# EAGLE design hibrido (EAGLE 9.6.2)
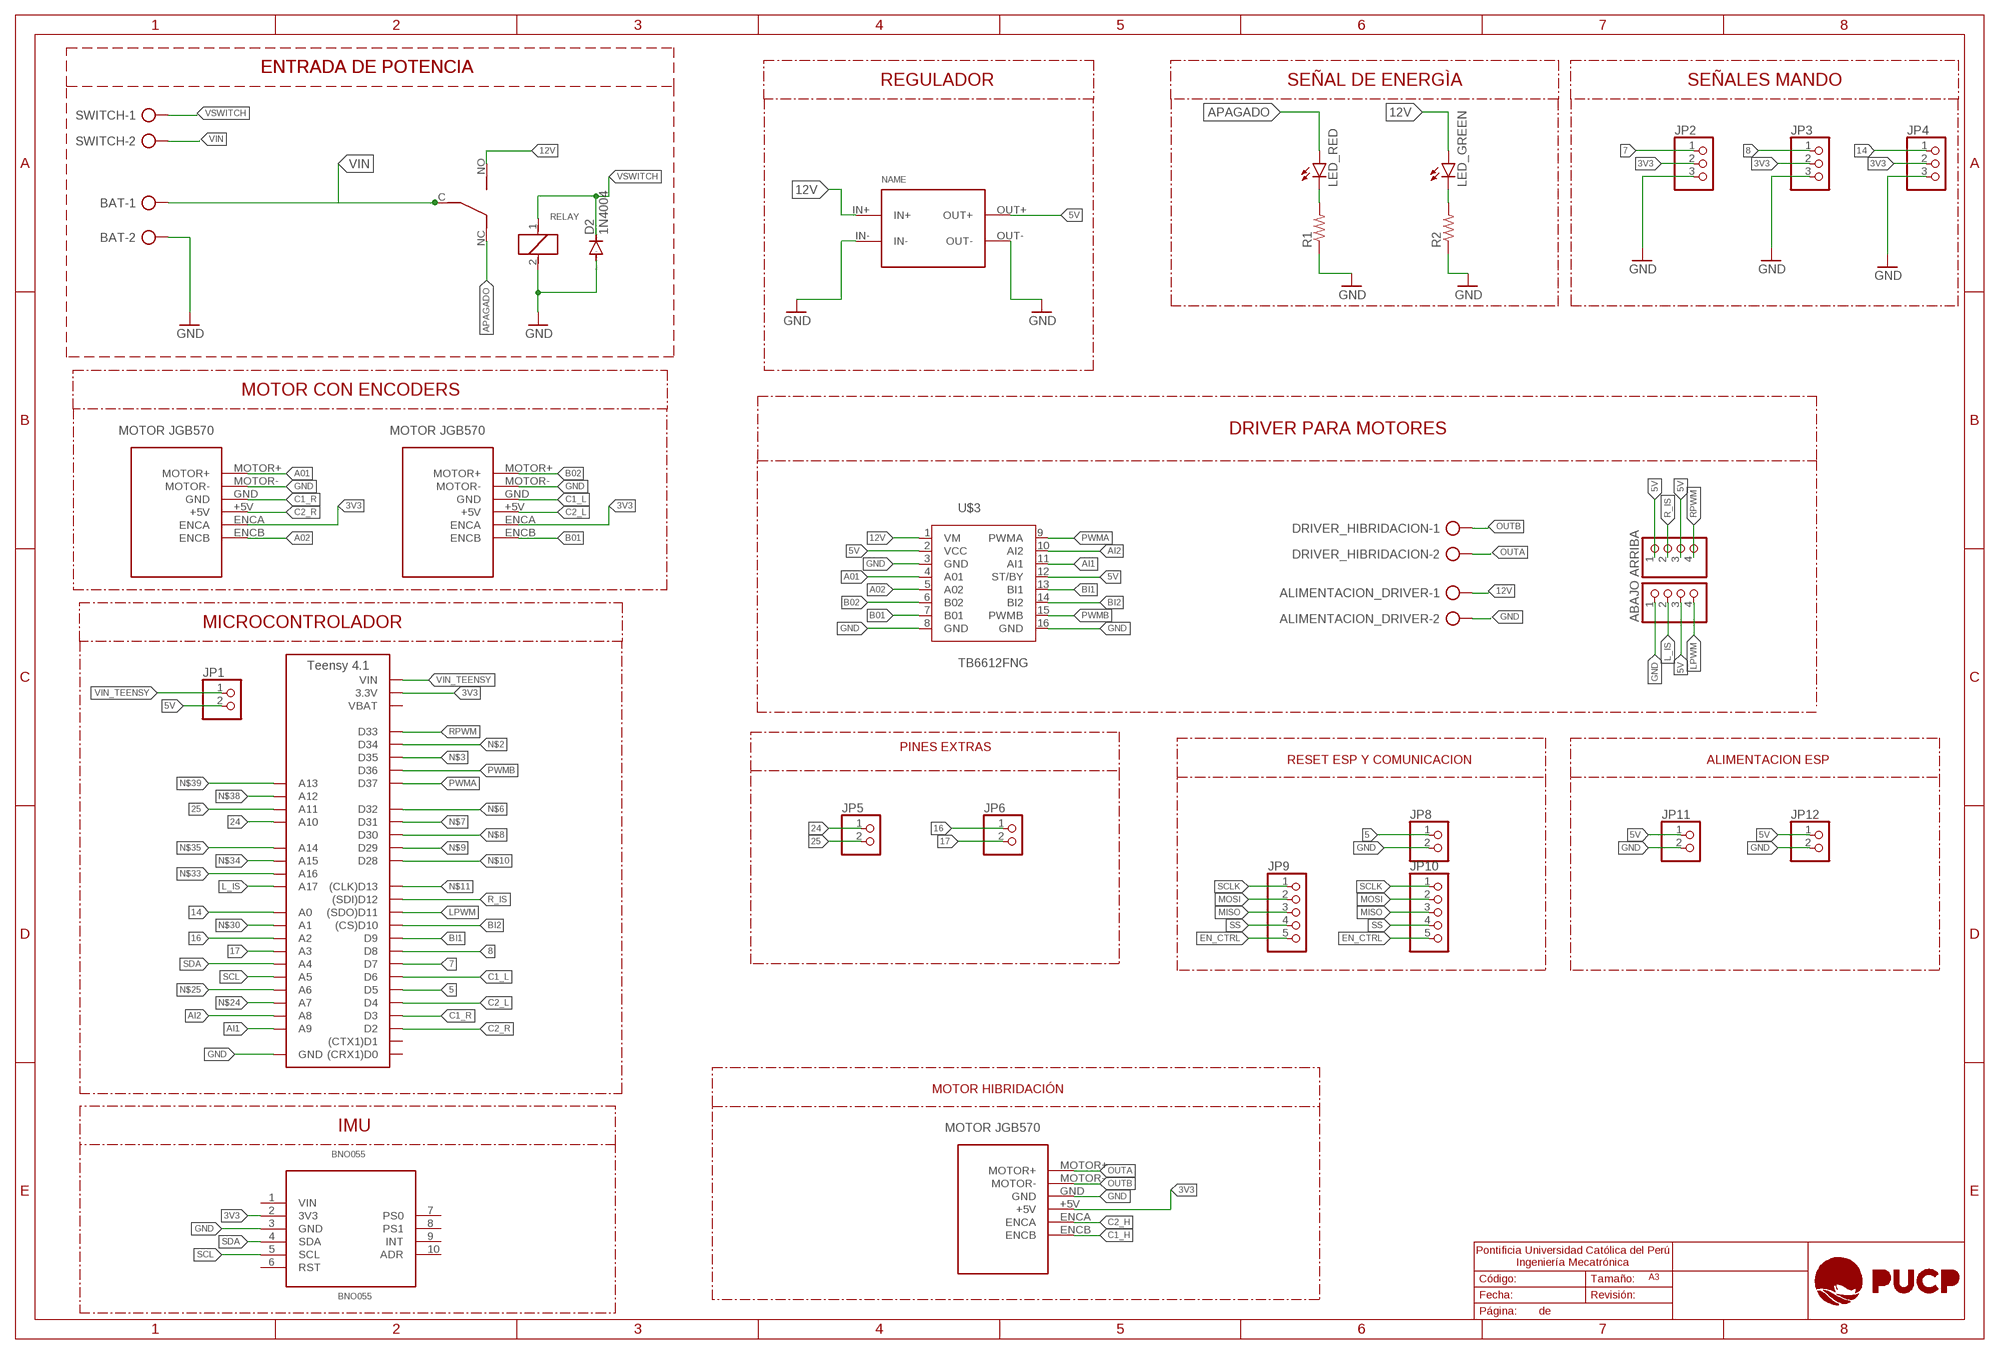
[diagram p0: schematic, sheet 1]

## Parts
A1  TEENSY_4.1  [TEENSY_LONG_EXT]
ABAJO  PINHD-1X4  [1X04]
ALIMENTACION_DRIVER  AK500/2-H  [AK500/2-H]
ARRIBA  PINHD-1X4  [1X04]
BAT  AK500/2-H  [AK500/2-H]
BNO055  BNO055  [BNO055]
D2  1N4004  [DO41-10]
DRIVER_HIBRIDACION  AK500/2-H  [AK500/2-H]
JP1  PINHD-1X2  [1X02]
JP2  PINHD-1X3  [1X03]
JP3  PINHD-1X3  [1X03]
JP4  PINHD-1X3  [1X03]
JP5  PINHD-1X2  [1X02]
JP6  PINHD-1X2  [1X02]
JP8  PINHD-1X2  [1X02]
JP9  PINHD-1X5  [1X05]
JP10  PINHD-1X5  [1X05]
JP11  PINHD-1X2  [1X02]
JP12  PINHD-1X2  [1X02]
LED_GREEN  LED5MM  [LED5MM]
LED_RED  LED5MM  [LED5MM]
MOTOR1  MOTOR_JGB370  [MOTOR_JGB370]
MOTOR3  MOTOR_JGB370  [MOTOR_JGB370]
MOTOR5  MOTOR_JGB370  [MOTOR_JGB370]
R1  R-US_0207/10  [0207/10]
R2  R-US_0207/10  [0207/10]
REG  CP8-ADJ  [CP8-ADJ]
RELAY  RELAY12V  [RELAY12V]
SWITCH  AK500/2-H  [AK500/2-H]
U$3  TB6612FNG  [TB6612FNG]

## Nets
3V3: A1.3V3(3.3V) A1.3V3@2(3.3V) A1.3V3@3(3.3V) BNO055.2(3V3) JP2.2 JP3.2 JP4.2 MOTOR1.+5V MOTOR3.ENCA MOTOR5.ENCA
5: A1.D5 JP8.1
5V: ABAJO.3 ARRIBA.1 ARRIBA.3 JP1.2 JP11.1 JP12.1 REG.OUT+ U$3.2(VCC) U$3.12(ST/BY)
7: A1.D7 JP2.1
8: A1.D8 JP3.1
12V: ALIMENTACION_DRIVER.1 LED_GREEN.A REG.IN+ RELAY.NO U$3.1(VM)
14: A1.D14(A0) JP4.1
16: A1.D16(A2) JP6.1
17: A1.D17(A3) JP6.2
24: A1.D24(A10) JP5.1
25: A1.D25(A11) JP5.2
A01: MOTOR3.MOTOR+ U$3.4(A01)
A02: MOTOR3.ENCB U$3.5(A02)
AI1: A1.D23(A9) U$3.11(AI1)
AI2: A1.D22(A8) U$3.10(AI2)
APAGADO: LED_RED.A RELAY.NC
B01: MOTOR5.ENCB U$3.7(B01)
B02: MOTOR5.MOTOR+ U$3.6(B02)
BI1: A1.D9 U$3.13(BI1)
BI2: A1.D10((CS)D10) U$3.14(BI2)
C1_H: MOTOR1.ENCB
C1_L: A1.D6 MOTOR5.GND
C1_R: A1.D3 MOTOR3.GND
C2_H: MOTOR1.ENCA
C2_L: A1.D4 MOTOR5.+5V
C2_R: A1.D2 MOTOR3.+5V
EN_CTRL: JP9.5 JP10.5
GND: A1.AGND/GND(GND) A1.GND A1.GND@2(GND) ABAJO.1 ALIMENTACION_DRIVER.2 BAT.2 BNO055.3(GND) D2.A JP2.3 JP3.3 JP4.3 JP8.2 JP11.2 JP12.2 MOTOR1.GND MOTOR3.MOTOR- MOTOR5.MOTOR- R1.1 R2.1 REG.IN- REG.OUT- RELAY.2 U$3.3(GND) U$3.8(GND) U$3.16(GND)
L_IS: A1.D41(A17) ABAJO.2
LPWM: A1.D11((SDO)D11) ABAJO.4
MISO: JP9.3 JP10.3
MOSI: JP9.2 JP10.2
N$1: LED_RED.K(C) R1.2
N$2: A1.D34
N$3: A1.D35
N$4: LED_GREEN.K(C) R2.2
N$6: A1.D32
N$7: A1.D31
N$8: A1.D30
N$9: A1.D29
N$10: A1.D28
N$11: A1.D13((CLK)D13)
N$24: A1.D21(A7)
N$25: A1.D20(A6)
N$30: A1.D15(A1)
N$33: A1.D40(A16)
N$34: A1.D39(A15)
N$35: A1.D38(A14)
N$38: A1.D26(A12)
N$39: A1.D27(A13)
OUTA: DRIVER_HIBRIDACION.2 MOTOR1.MOTOR+
OUTB: DRIVER_HIBRIDACION.1 MOTOR1.MOTOR-
PWMA: A1.D37 U$3.9(PWMA)
PWMB: A1.D36 U$3.15(PWMB)
R_IS: A1.D12((SDI)D12) ARRIBA.2
RPWM: A1.D33 ARRIBA.4
SCL: A1.D19(A5) BNO055.5(SCL)
SCLK: JP9.1 JP10.1
SDA: A1.D18(A4) BNO055.4(SDA)
SS: JP9.4 JP10.4
VIN: BAT.1 RELAY.C SWITCH.2
VIN_TEENSY: A1.VIN JP1.1
VSWITCH: D2.C RELAY.1 SWITCH.1
Unconnected: A1.D0((CRX1)D0) A1.D1((CTX1)D1) BNO055.1(VIN) BNO055.6(RST) BNO055.7(PS0) BNO055.8(PS1) BNO055.9(INT) BNO055.10(ADR)

## Notes on the sheet
- ENTRADA DE POTENCIA | ENTRADA DE POTENCIA
- REGULADOR | SEÑAL DE ENERGÌA | SEÑALES MANDO
- MOTOR CON ENCODERS
- DRIVER PARA MOTORES
- MICROCONTROLADOR
- PINES EXTRAS
- RESET ESP Y COMUNICACION | ALIMENTACION ESP
- MOTOR HIBRIDACIÓN
- IMU
- A3

## Power pins joined to a net without a drawn wire
VBAT: A1.VBAT

## Library data of the parts
A1 = TEENSY_4.1:TEENSY_4.1: Check availability <https://pricing.snapeda.com/parts/Teensy%204.1/PJRC/view-part?ref=eda>; AVAILABILITY: Not in stock; CHECK_PRICES: https://www.snapeda.com/parts/Teensy%204.1/PJRC/view-part/?ref=eda; MF: PJRC; MP: Teensy 4.1; PACKAGE: None; PRICE: None; SNAPEDA_LINK: https://www.snapeda.com/parts/Teensy%204.1/PJRC/view-part/?ref=snap
ABAJO ARRIBA = pinhead:PINHD-1X4: PIN HEADER
ALIMENTACION_DRIVER BAT DRIVER_HIBRIDACION SWITCH = con-ptr500:AK500/2-H: CONNECTOR Aug. 2004 / PTR Meßtechnik: Die Bezeichnung der Serie AK505 wurde geändert. Es handelt sich hierbei um AK500 in horizontaler Ausführung.; OC_FARNELL: unknown; OC_NEWARK: unknown
BNO055 = BNO055:BNO055
D2 = diode:1N4004: DIODE general purpose rectifier, 1 A
JP1 JP5 JP6 JP8 JP11 JP12 = pinhead:PINHD-1X2: PIN HEADER
JP2-JP4 = pinhead:PINHD-1X3: PIN HEADER
JP9 JP10 = pinhead:PINHD-1X5: PIN HEADER
LED_GREEN LED_RED = led:LED: LED OSRAM: - CHIPLED LG R971, LG N971, LY N971, LG Q971, LY Q971, LO R971, LY R971 LH N974, LH R974 LS Q976, LO Q976, LY Q976 LO Q996 - Hyper CHIPLED LW Q18S LB Q993, LB Q99A, LB R99A - SideLED LS A670, LO A670, LY A670, LG A670, LP A670 LB A673, LV A673, LT A673, LW A673 LH A674 LY A675 LS A676, LA A676, LO A676, LY A676, LW A676 LS A679, LY A679, LG A679 - Hyper Micro SIDELED® LS Y876, LA Y876, LO Y876, LY Y876 LT Y87S - SmartLED LW L88C, LW L88S LB L89C, LB L89S, LG L890 LS L89K, LO L89K, LY L89K LS L896, LA L896, LO L896, LY L896 - TOPLED LS T670, LO T670, LY T670, LG T670, LP T670 LSG T670, LSP T670, LSY T670, LOP T670, LYG T670 LG T671, LOG T671, LSG T671 LB T673, LV T673, LT T673, LW T673 LH T674 LS T676, LA T676, LO T676, LY T676, LB T676, LH T676, LSB T676, LW T676 LB T67C, LV T67C, LT T67C, LS T67K, LO T67K, LY T67K, LW E67C LS E67B, LA E67B, LO E67B, LY E67B, LB E67C, LV E67C, LT E67C LW T67C LS T679, LY T679, LG T679 LS T770, LO T770, LY T770, LG T770, LP T770 LB T773, LV T773, LT T773, LW T773 LH T774 LS E675, LA E675, LY E675, LS T675 LS T776, LA T776, LO T776, LY T776, LB T776 LHGB T686 LT T68C, LB T68C - Hyper Mini TOPLED® LB M676 - Mini TOPLED Santana® LG M470 LS M47K, LO M47K, LY M47K Source: http://www.osram.convergy.de LUXEON: - LUMILED® LXK2-PW12-R00, LXK2-PW12-S00, LXK2-PW14-U00, LXK2-PW14-V00 LXK2-PM12-R00, LXK2-PM12-S00, LXK2-PM14-U00 LXK2-PE12-Q00, LXK2-PE12-R00, LXK2-PE12-S00, LXK2-PE14-T00, LXK2-PE14-U00 LXK2-PB12-K00, LXK2-PB12-L00, LXK2-PB12-M00, LXK2-PB14-N00, LXK2-PB14-P00, LXK2-PB14-Q00 LXK2-PR12-L00, LXK2-PR12-M00, LXK2-PR14-Q00, LXK2-PR14-R00 LXK2-PD12-Q00, LXK2-PD12-R00, LXK2-PD12-S00 LXK2-PH12-R00, LXK2-PH12-S00 LXK2-PL12-P00, LXK2-PL12-Q00, LXK2-PL12-R00 Source: www.luxeon.com KINGBRIGHT: KA-3528ASYC Source: www.kingbright.com
MOTOR1 MOTOR3 MOTOR5 = MOTOR_JGB370:MOTOR_JGB370
R1 R2 = rcl:R-US_: RESISTOR, American symbol; SPICEPREFIX: R
REG = userlib:CP8-ADJ: Voltage regulator IN: 7-35V OUT: ADJ; SPICEPREFIX: E
RELAY = ModularRobot:RELAY12V: Library for the 12V relay component available in Peru. Done by Jimm Cisneros.
U$3 = TB6612FNG:TB6612FNG

## Board
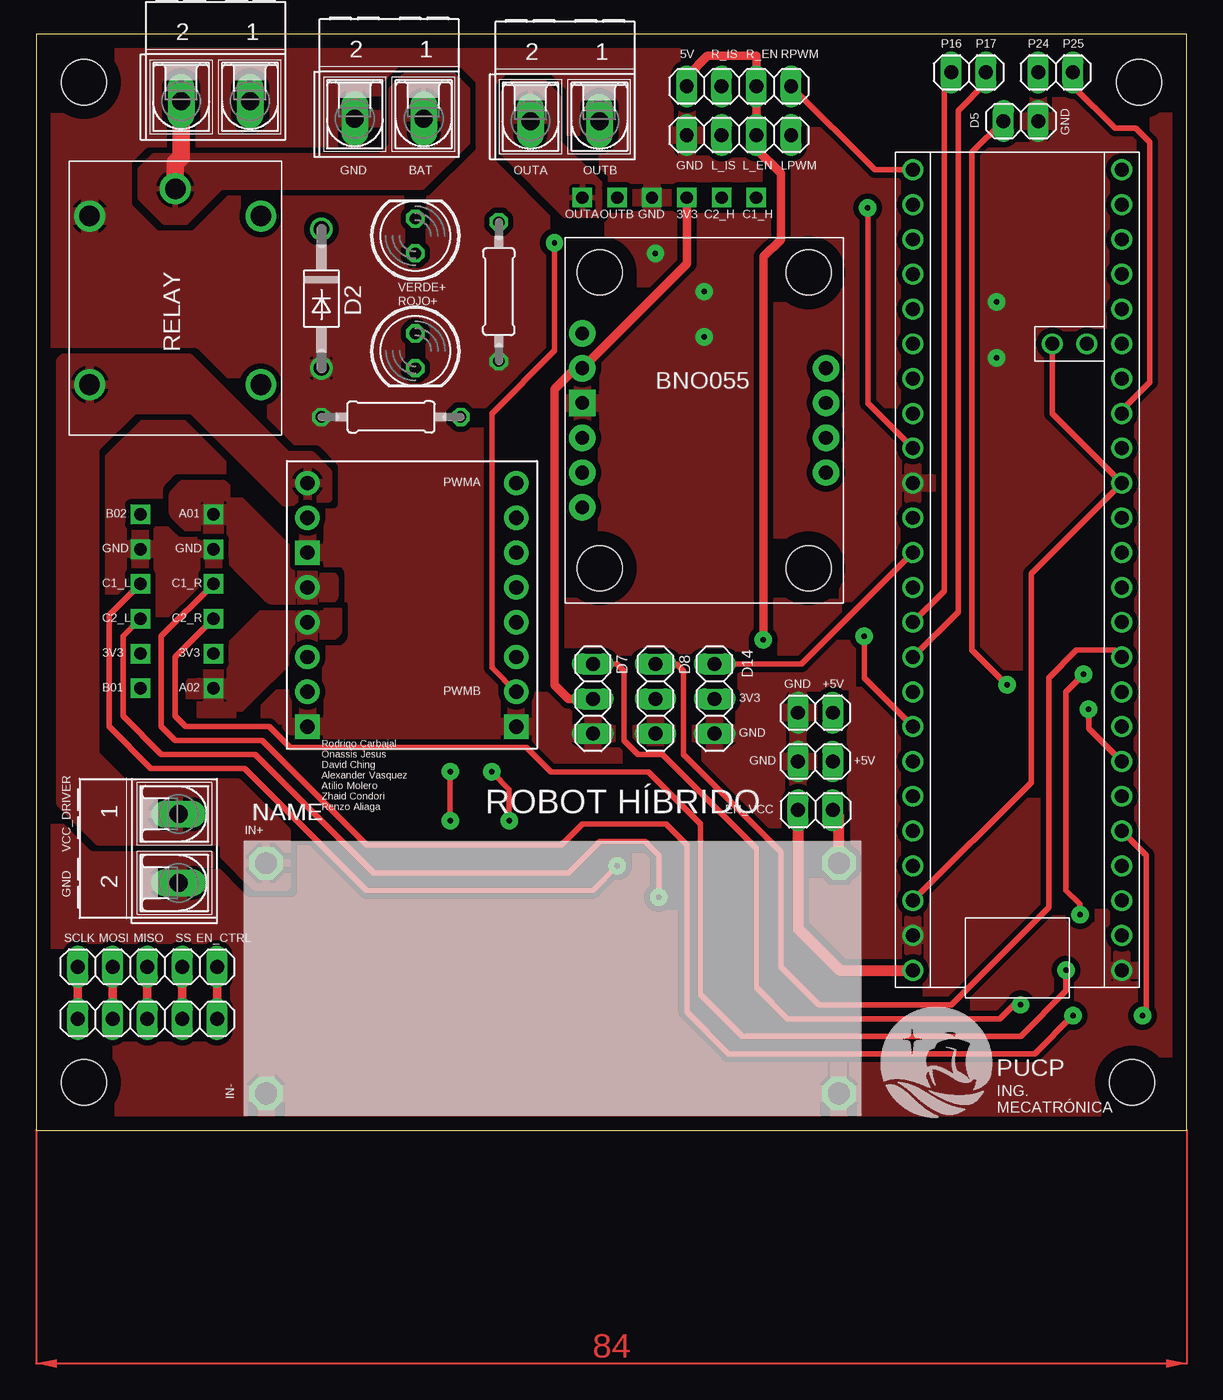
[diagram p1: board, top side]
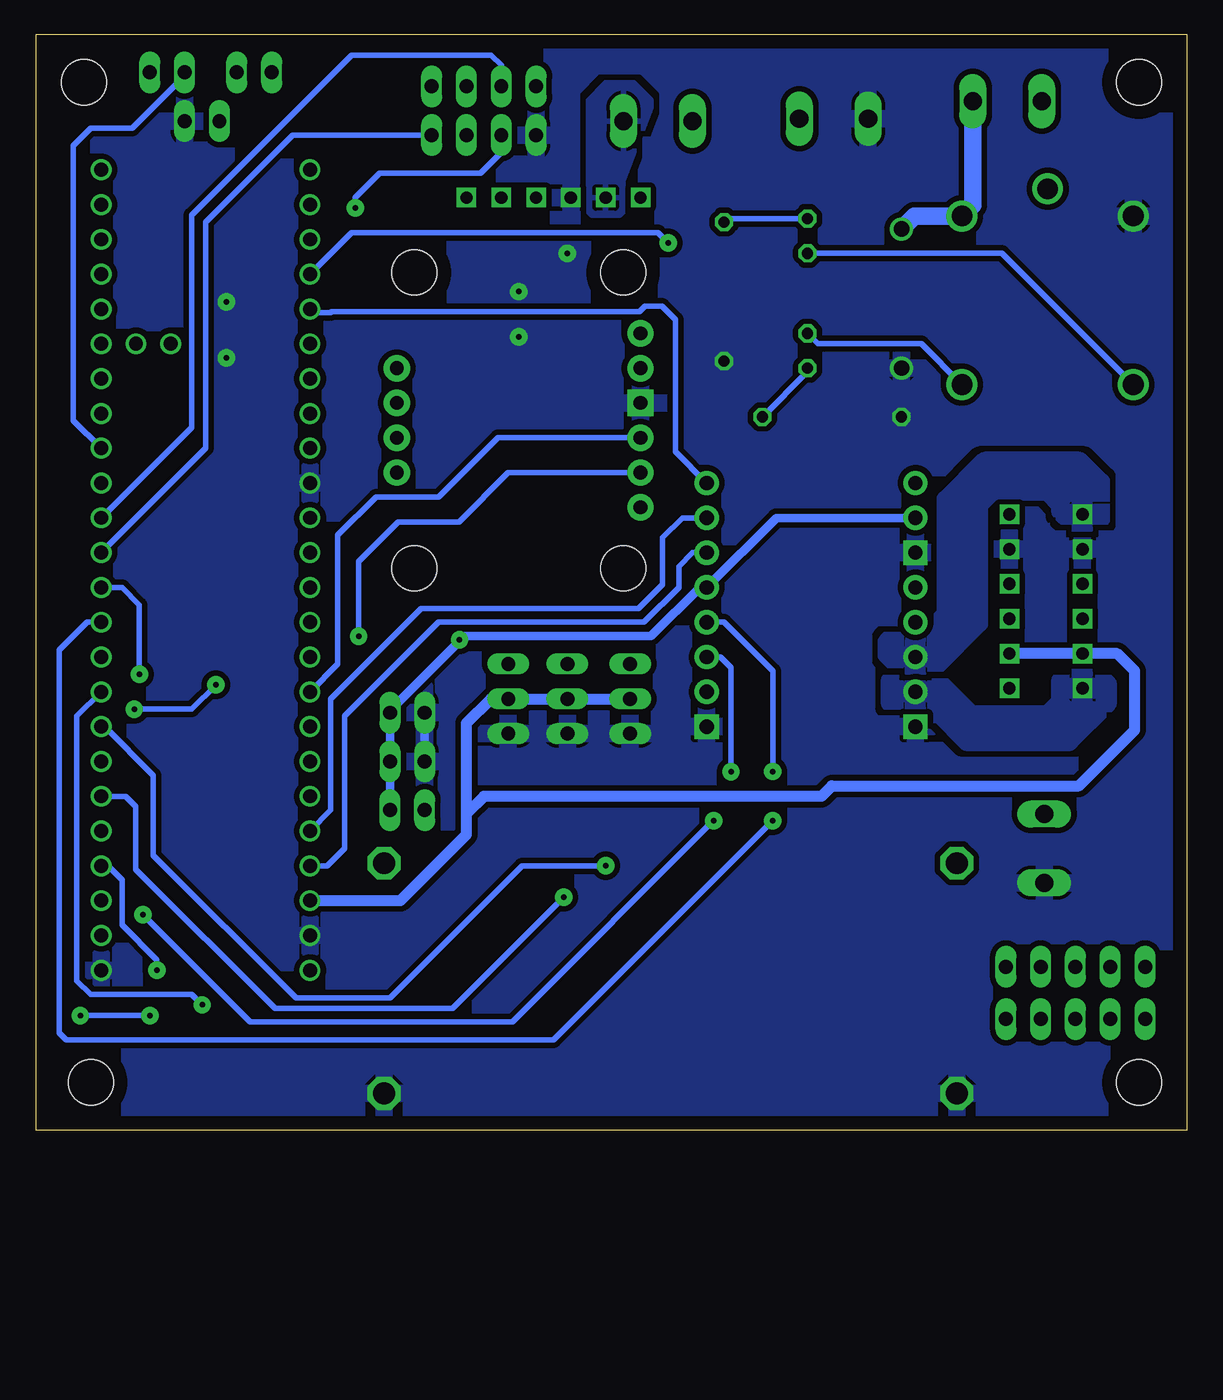
[diagram p2: board, bottom side, seen from below]

Size 84 x 80 mm. Coordinates in mm from the lower left corner, seen from the top.
Outline: 0,0 84,0 84,80 0,80 0,0
Copper layers (1*16): Top 0.035mm / dielectric 1.5mm / Bottom 0.035mm
Design rules "default *": minimum track width 6mil, minimum drill 0.35mm, track to track 12mil, track to pad 12mil, pad to pad 12mil, via to via 12mil, smd to smd 6mil, copper to edge 40mil, drill to drill 6mil, minimum pad ring 10mil, minimum via ring 8mil, stop-mask expansion 4mil, vias tented up to drill 0mil, thermal gap 10mil
Holes 3.3 mm at 3.5,76.5 3.5,3.5 80,3.5 80.5,76.5

### Footprints (pad centres in the part's own frame; a part is rotated, then mirrored left to right if it is on the bottom)
TEENSY_LONG_EXT = drill 1.016: 3V3 0,5.08; 3V3@2 15.24,35.56; 3V3@3 10.16,45.72; AGND/GND 0,2.54; D0 15.24,2.54; D1 15.24,5.08; D2 15.24,7.62; D3 15.24,10.16; D4 15.24,12.7; D5 15.24,15.24; D6 15.24,17.78; D7 15.24,20.32; D8 15.24,22.86; D9 15.24,25.4; D10 15.24,27.94; D11 15.24,30.48; D12 15.24,33.02; D13 0,33.02; D14 0,30.48; D15 0,27.94; D16 0,25.4; D17 0,22.86; D18 0,20.32; D19 0,17.78; D20 0,15.24; D21 0,12.7; D22 0,10.16; D23 0,7.62; D24 15.24,38.1; D25 15.24,40.64; D26 15.24,43.18; D27 15.24,45.72; D28 15.24,48.26; D29 15.24,50.8; D30 15.24,53.34; D31 15.24,55.88; D32 15.24,58.42; D33 0,58.42; D34 0,55.88; D35 0,53.34; D36 0,50.8; D37 0,48.26; D38 0,45.72; D39 0,43.18; D40 0,40.64; D41 0,38.1; GND 15.24,0; GND@2 0,35.56; VBAT 12.7,45.72; VIN 0,0
1X04 = drill 1.016 long: 1 -3.81,0; 2 -1.27,0; 3 1.27,0; 4 3.81,0
AK500/2-H = drill 1.321 long: 1 -2.515,0; 2 2.515,0
BNO055 = drill 1 pad 1.93: 1 -8.89,6.35; 2 -8.89,3.81; 4 -8.89,-1.27; 5 -8.89,-3.81; 6 -8.89,-6.35; 7 8.89,3.81; 8 8.89,1.27; 9 8.89,-1.27; 10 8.89,-3.81 | drill 1 pad 1.93 square: 3 -8.89,1.27 | hole 3.3: -7.62,10.795; 7.62,10.795; -7.62,-10.795; 7.62,-10.795
DO41-10 = drill 1.118: A 5.08,0; C -5.08,0
1X02 = drill 1.016 long: 1 -1.27,0; 2 1.27,0
1X03 = drill 1.016 long: 1 -2.54,0; 2 0,0; 3 2.54,0
1X05 = drill 1.016 long: 1 -5.08,0; 2 -2.54,0; 3 0,0; 4 2.54,0; 5 5.08,0
LED5MM = drill 0.813 octagon: A -1.27,0; K 1.27,0
MOTOR_JGB370 = drill 0.9 pad 1.422 square: +5V -2.54,0; ENCA -5.08,0; ENCB -7.62,0; GND 0,0; MOTOR+ 5.08,0; MOTOR- 2.54,0
0207/10 = drill 0.813 octagon: 1 -5.08,0; 2 5.08,0
CP8-ADJ = drill 1.6 octagon: IN+ -21.81,7.05; IN- -21.81,-9.75; OUT+ 19.99,7.05; OUT- 19.99,-9.75
RELAY12V = drill 1.5: 1 16,-14; 2 16,-1.5; C 18,-7.75; NC 3.7,-14; NO 3.7,-1.5
TB6612FNG = drill 1.04 pad 1.778: 1 -7.62,8.89; 2 -7.62,6.35; 4 -7.62,1.27; 5 -7.62,-1.27; 6 -7.62,-3.81; 7 -7.62,-6.35; 9 7.62,8.89; 10 7.62,6.35; 11 7.62,3.81; 12 7.62,1.27; 13 7.62,-1.27; 14 7.62,-3.81; 15 7.62,-6.35 | drill 1.04 pad 1.778 square: 3 -7.62,3.81; 8 -7.62,-8.89; 16 7.62,-8.89

### Placement (x,y rotation side)
A1  64.01,11.68 0 top
ABAJO  51.31,72.64 0 top
ALIMENTACION_DRIVER  10.41,20.57 270 top
ARRIBA  51.31,76.2 0 top
BAT  25.78,73.84 180 top
BNO055  48.77,51.82 0 top
D2  20.83,60.71 270 top
DRIVER_HIBRIDACION  38.61,73.66 180 top
JP1  56.9,23.37 0 top
JP2  40.64,31.5 270 top
JP3  45.21,31.5 270 top
JP4  49.53,31.5 270 top
JP5  74.42,77.22 0 top
JP6  68.07,77.22 0 top
JP8  71.88,73.66 0 top
JP9  8.13,11.94 0 top
JP10  8.13,8.13 0 top
JP11  56.9,26.92 180 top
JP12  56.9,30.48 180 top
LED_GREEN  27.69,65.28 90 top
LED_RED  27.69,56.9 270 top
MOTOR1  44.96,68.07 180 top
MOTOR3  12.95,39.88 90 top
MOTOR5  7.62,39.88 90 top
R1  25.91,52.07 0 top
R2  33.78,61.21 90 top
REG  38.61,12.45 0 top
RELAY  2.41,50.73 90 top
SWITCH  13.11,75.11 180 top
U$3  27.43,38.35 0 top

### Tracks (layer width: path | path; a pad name or v marks a point on that pad's centre or on a via)
3V3
  Top 0.406: A1.3V3 72.64,25.4 72.64,40.64 A1.3V3@2 74.17,52.32 A1.3V3@3
  Top 0.61: JP2.2 38.86,31.5 37.85,32.51 37.85,54.1 39.37,55.63 BNO055.2 47.5,63.25 MOTOR1.+5V
  Bottom 0.813: A1.3V3 57.4,16.76 52.58,21.59 52.58,23.11 | JP2.2 JP3.2 JP4.2 50.8,31.5 52.58,29.72 52.58,23.11 | MOTOR3.ENCA MOTOR5.ENCA 5.08,34.8 3.81,33.53 3.81,29.21 7.87,25.15 25.91,25.15 26.67,24.38 51.31,24.38 52.58,23.11
5  (via drill 0.4 pad 1.27)
  Top 0.406: JP8.1 68.33,71.37 68.33,35.05 v70.87,32.51 | v76.83,30.73 76.83,29.34 A1.D5
  Bottom 0.406: v70.87,32.51 72.64,30.73 v76.83,30.73
5V  (via drill 0.4 pad 1.27)
  Top 0.61: v53.09,35.81 53.09,63.75 54.36,65.02 54.36,69.85 52.58,71.63 ABAJO.3 ARRIBA.3 52.58,78.44 49.02,78.44 47.5,76.91 ARRIBA.1
  Top 0.813: REG.OUT+ 58.6,22.94 JP1.2
  Bottom 0.61: U$3.2 29.97,44.7 U$3.12 35.55,39.62 39.11,36.07 52.83,36.07 v53.09,35.81 53.09,35.72 58.17,30.64 JP12.1 JP11.1 JP1.2
7  (via drill 0.4 pad 1.27)
  Top 0.406: JP2.1 42.42,34.04 42.93,33.53 42.93,28.45 43.94,27.43 45.72,27.43 52.58,20.57 52.58,10.41 54.86,8.13 70.36,8.13 71.39,9.15 v71.87,9.15
  Bottom 0.406: v71.87,9.15 72.63,9.92 80.02,9.92 81.03,10.92 81.03,30.23 A1.D7
8
  Top 0.406: JP3.1 46.74,34.04 47.24,33.53 47.24,27.43 54.36,20.32 54.36,11.94 57.15,9.14 66.8,9.14 73.91,16.26 73.91,33.02 75.95,35.05 78.74,35.05 A1.D8
12V
  Bottom 0.406: RELAY.NO 13.49,64.01 LED_GREEN.A
  pour Top (isolate 0.406): 2.54,56.39 11.18,56.39 18.29,49.28 20.07,49.28 21.34,48.01 21.34,46.13 18.2,45.81 11.43,52.58 2.29,52.58 1.78,53.09 1.78,55.63
  pour Top (isolate 0.406): 2.03,56.39 5.84,56.39 7.11,55.12 7.11,52.58 4.32,49.78 4.32,27.43 6.35,25.4 12.19,25.4 13.21,24.38 13.21,22.1 12.19,21.08 4.57,21.08 1.78,23.88 1.78,56.13
  pour Top: 8.89,25.4 14.73,25.4 18.29,21.84 18.29,17.78 16,17.78 13.72,20.07 13.72,20.83 13.46,21.08 8.89,21.08 8.13,21.84 8.13,24.64
14
  Top 0.406: JP4.1 55.88,34.04 A1.D14
16
  Top 0.406: JP6.1 66.29,76.71 66.29,39.37 A1.D16
17
  Top 0.406: JP6.2 69.34,76.45 67.31,74.42 67.31,37.85 A1.D17
24
  Bottom 0.406: JP5.1 73.15,76.96 76.98,73.13 80.01,73.13 81.28,71.86 81.28,51.82 A1.D24
25
  Top 0.406: JP5.2 75.69,76.2 78.76,73.13 80.26,73.13 81.28,72.11 81.28,54.61 79.25,52.58 A1.D25
A01
  pour Top (isolate 0.406): 19.56,40.64 20.83,40.64 21.34,40.13 21.34,39.12 17.27,39.12 12.7,43.69 11.94,43.69 10.41,45.21 10.41,46.23 10.92,46.74 13.46,46.74
A02
  pour Top (isolate 0.406, rank 2): 17.27,37.85 21.59,37.85 21.59,36.58 20.57,35.56 19.05,35.56 14.22,30.73 12.19,30.73 11.68,31.24 11.68,32.51 12.95,33.78 13.21,33.78
AI1
  Bottom 0.406: U$3.11 36.07,42.16 37.08,41.15 37.08,39.62 39.62,37.08 54.61,37.08 61.47,30.23 61.47,20.57 62.74,19.3 A1.D23
AI2
  Bottom 0.406: U$3.10 36.83,44.7 38.28,43.26 38.28,39.83 40.01,38.1 55.88,38.1 62.48,31.5 62.48,23.37 A1.D22
APAGADO
  Bottom 0.406: RELAY.NC 19.39,57.4 26.92,57.4 LED_RED.A
B01
  pour Bottom (isolate 0.406, rank 2): 19.3,33.78 20.57,33.78 21.59,32.77 21.59,31.24 20.83,30.48 18.03,30.48 16,28.45 8.64,28.45 5.84,31.24 5.84,32.51 6.35,33.02 8.89,33.02 9.14,32.77 9.14,31.24 10.16,30.23 15.75,30.23
B02
  pour Bottom (isolate 0.406): 18.8,36.32 21.08,36.32 21.84,35.56 21.84,34.8 21.08,34.04 18.29,34.04 15.24,37.08 15.24,45.72 14.22,46.74 10.16,46.74 9.14,45.72 9.14,45.21 8.38,44.45 6.6,44.45 6.35,44.7 6.35,47.24 7.87,48.77 14.73,48.77 17.53,45.97 17.53,37.59
BI1  (via drill 0.4 pad 1.27)
  Top 0.406: v30.23,26.19 v30.23,22.61
  Bottom 0.406: U$3.13 33.78,37.08 30.23,33.53 v30.23,26.19 | v30.23,22.61 46.23,6.6 81.79,6.6 82.3,7.11 82.3,35.05 80.26,37.08 A1.D9
BI2  (via drill 0.4 pad 1.27)
  Top 0.406: v33.27,26.16 34.54,24.89 v34.54,22.61 | v76.45,33.27 75.18,32 75.18,17.53 76.2,16.51 v76.2,15.75
  Bottom 0.406: U$3.14 34.04,34.54 33.27,33.78 v33.27,26.16 | v34.54,22.61 49.23,7.92 68.38,7.92 v76.2,15.75 | v76.45,33.27 76.45,38.35 77.72,39.62 A1.D10
C1_L  (via drill 0.4 pad 1.27)
  Top 0.406: MOTOR5.GND 5.33,37.59 5.33,29.46 8.38,26.42 15.24,26.42 24.13,17.53 40.64,17.53 v42.42,19.3
  Bottom 0.406: v42.42,19.3 48.51,19.3 58.17,9.65 65.02,9.65 75.44,20.07 75.44,25.91 78.99,29.46 A1.D6
C1_R  (via drill 0.4 pad 1.27)
  Top 0.406: MOTOR3.GND 9.14,36.07 9.14,29.46 10.16,28.45 16.51,28.45 24.13,20.83 38.35,20.83 39.88,22.35 45.97,22.35 47.5,20.83 47.5,8.64 50.55,5.59 72.9,5.59 v75.69,8.38 | A1.D3 81.03,20.07 81.03,8.64 v80.77,8.38
  Bottom 0.406: v80.77,8.38 v75.69,8.38
C2_L  (via drill 0.4 pad 1.27)
  Top 0.406: MOTOR5.+5V 6.35,36.07 6.35,30.23 9.14,27.43 16,27.43 24.64,18.8 38.86,18.8 41.15,21.08 44.45,21.08 45.47,20.07 v45.47,17.02
  Bottom 0.406: v45.47,17.02 53.59,8.89 66.55,8.89 76.71,19.05 76.71,23.62 77.47,24.38 A1.D4
C2_R  (via drill 0.4 pad 1.27)
  Top 0.406: MOTOR3.+5V 10.16,34.54 10.16,30.23 10.92,29.46 17.02,29.46 18.54,27.94 35.81,27.94 37.59,26.16 44.7,26.16 48.51,22.35 48.51,9.91 51.56,6.86 71.88,6.86 75.18,10.16 v75.18,11.68
  Bottom 0.406: v75.18,11.68 75.18,12.45 77.72,14.99 77.72,18.29 78.74,19.3 A1.D2
EN_CTRL
  Top 0.61: JP10.5 JP9.5
GND  (via drill 0.4 pad 1.27)
  Bottom 0.61: JP12.2 JP11.2
  other vias: 48.77,61.21 45.21,64.01 48.77,57.91 70.1,56.39 70.1,60.45
  pour Top (isolate 0.406, rank 6): -12.7,-5.08 -12.7,78.74 1.27,92.71 92.71,92.71 102.62,82.8 102.62,-0.25 92.71,-10.16 -7.62,-10.16
  pour Bottom (isolate 0.406, rank 5): -9.91,72.9 5.84,88.65 76.71,88.65 90.42,74.93 90.42,-1.78 84.58,-7.62 -4.32,-7.62 -9.91,-2.03
L_IS  (via drill 0.4 pad 1.27)
  Top 0.406: v60.71,67.31 60.71,53.09 A1.D41
  Bottom 0.406: ABAJO.2 50.04,71.37 51.56,69.85 58.93,69.85 60.71,68.07 v60.71,67.31
LPWM
  Bottom 0.406: ABAJO.4 65.28,72.64 71.63,66.29 71.63,49.78 A1.D11
MISO
  Top 0.61: JP10.3 JP9.3
MOSI
  Top 0.61: JP10.2 JP9.2
N$1
  Bottom 0.406: R1.2 27.69,55.37 LED_RED.K
N$4
  Bottom 0.406: LED_GREEN.K 33.53,66.55 R2.2
OUTA
  pour Top (isolate 0.406): 34.8,76.45 37.08,76.45 38.1,75.44 38.1,72.14 41.15,69.09 41.15,67.06 40.89,66.8 38.61,66.8 34.04,71.37 34.04,75.69
OUTB
  pour Bottom (isolate 0.406): 39.12,74.68 39.12,75.18 40.39,76.45 42.42,76.45 43.69,75.18 43.69,67.06 43.43,66.8 41.4,66.8 41.15,67.06 41.15,69.34
PWMA
  Bottom 0.406: U$3.9 37.34,49.53 37.34,59.18 38.29,60.14 39.56,60.14 39.96,59.74 62.43,59.74 62.48,59.69 63.75,59.69 A1.D37
PWMB  (via drill 0.4 pad 1.27)
  Top 0.406: U$3.15 33.27,33.78 33.27,52.32 37.85,56.9 v37.85,64.77
  Bottom 0.406: v37.85,64.77 38.61,65.53 60.96,65.53 A1.D36
R_IS
  Bottom 0.406: ARRIBA.2 50.04,77.72 50.8,78.49 60.96,78.49 72.64,66.8 72.64,51.31 A1.D12
RPWM
  Top 0.406: ARRIBA.4 61.21,70.1 A1.D33
SCL  (via drill 0.4 pad 1.27)
  Top 0.406: v60.45,36.07 60.45,33.02 A1.D19
  Bottom 0.406: BNO055.5 49.53,48.01 53.14,44.4 57.58,44.4 60.45,41.52 v60.45,36.07
SCLK
  Top 0.61: JP10.1 JP9.1
SDA
  Bottom 0.406: BNO055.4 50.29,50.55 54.61,46.23 59.18,46.23 61.98,43.43 61.98,34.04 A1.D18
SS
  Top 0.61: JP10.4 JP9.4
VIN
  Top 1.27: SWITCH.2 10.59,71.04 10.16,70.61 RELAY.C | RELAY.C
  pour Top (isolate 0.406): 26.92,76.96 30.48,76.96 31.5,75.95 31.5,72.14 28.19,68.83 13.46,68.83 10.92,66.29 9.4,66.29 7.62,68.07 7.62,70.1 8.64,71.12 25.15,71.12 25.91,71.88 25.91,75.95
VIN_TEENSY
  Top 0.813: JP1.1 55.63,14.73 58.67,11.68 A1.VIN
VSWITCH
  Bottom 1.27: SWITCH.1 15.62,67.52 RELAY.1 19.89,66.73 D2.C
(copper drawn outside any net)
  shapes: Top area x1

### Text on the board
tNames: P16 | P17 | P24 | P25 | 5V | R_IS | R_EN | RPWM | D5 | GND | GND | BAT | OUTA | OUTB | GND | L_IS | L_EN | LPWM | OUTA | OUTB | GND | 3V3 | C2_H | C1_H | VERDE+ | ROJO+ | PWMA | B02 | A01 | GND | GND | C1_L | C1_R | C2_L | C2_R | 3V3 | 3V3 | D7 | D8 | D14 | B01 | A02 | PWMB | GND | +5V | 3V3 | GND | GND | +5V | Rodrigo Carbajal / Onassis Jesus / David Ching / Alexander Vasquez / Atilio Molero / Zhaid Condori / Renzo Aliaga | ROBOT HÍBRIDO | EN_VCC | IN+ | VCC_DRIVER | GND | SCLK | MOSI | MISO | SS | EN_CTRL | PUCP | IN- | ING. / MECATRÓNICA